# Altium schematic sheet bogdob.SchDoc
size A4; SheetNumber: 2; SheetTotal: 2
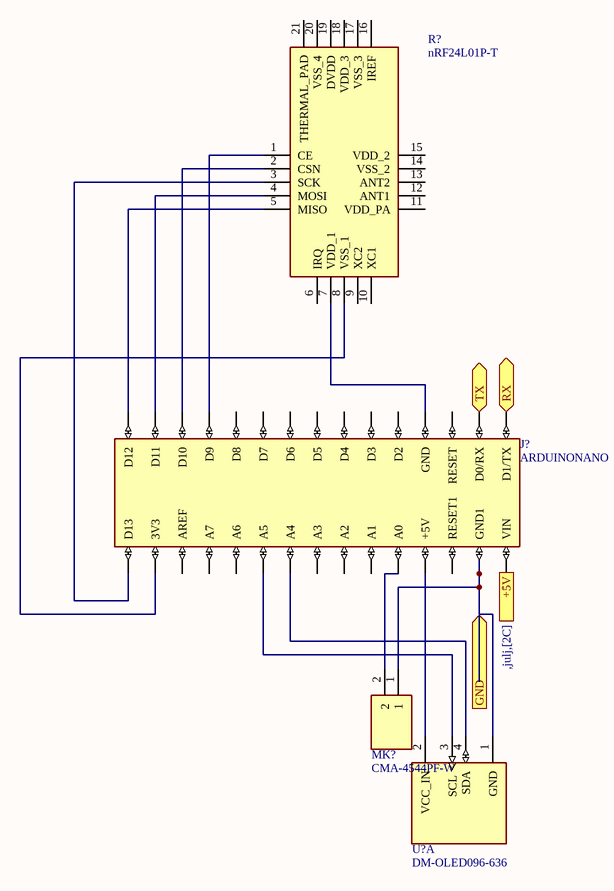
[diagram p0: bogdob.SchDoc]

## Parts
J?  ARDUINONANO  [PDIP-32]
MK?  CMA-4544PF-W  [CMA4544PFW]
R?  nRF24L01P-T  [QFN50P400X400X95-21N-D]
U?  DM-OLED096-636  [MODULE_DM-OLED096-636]  (part A of 6)

## Ports
+5V (in, see ,julj,[2C]), GND (in), RX (bidir), TX (bidir)

## Nets
RX: J?.D1/TX ; port RX
TX: J?.D0/RX ; port TX
NetJ?_3V3: J?.3V3 R?.8(VSS_1)
NetJ?_+5V: J?.+5V U?.2(VCC_IN)
NetJ?_A0: J?.A0 MK?.2
NetJ?_A4: J?.A4 U?.4(SDA)
NetJ?_A5: J?.A5 U?.3(SCL)
NetJ?_D9: J?.D9 R?.1(CE)
NetJ?_D10: J?.D10 R?.2(CSN)
NetJ?_D11: J?.D11 R?.4(MOSI)
NetJ?_D12: J?.D12 R?.5(MISO)
NetJ?_D13: J?.D13 R?.3(SCK)
NetJ?_GND: J?.GND R?.7(VDD_1)
NetJ?_GND1: J?.GND1 MK?.1 U?.1(GND)

Not connected (* = marked no-connect by the designer): J? A1 A2 A3 A6 A7 AREF D2 D3 D4 D5 D6 D7 D8 RESET RESET1 VIN; R? 6(IRQ) 9(XC2) 10(XC1) 11(VDD_PA) 12(ANT1) 13(ANT2) 14(VSS_2) 15(VDD_2) 16(IREF) 17(VSS_3) 18(VDD_3) 19(DVDD) 20(VSS_4) 21(THERMAL_PAD)

## Library data of the parts
J? = ARDUINONANO: NINA-W102, RP2040 Arduino Nano RP2040 Connect with Headers series ARMÂ® CortexÂ®-M0+ MCU 32-Bit Embedded Evaluation Board; Value: *; SnapEDA_Link: https://www.snapeda.com/parts/ARDUINONANO/Arduino/view-part/?ref=snap; MF: Arduino; Availability: Not in stock; Price: None; Package: Non-Standard Arduino; Check_prices: https://www.snapeda.com/parts/ARDUINONANO/Arduino/view-part/?ref=eda; MP: ARDUINONANO
MK? = CMA-4544PF-W: Microphone; Manufacturer_Name: CUI Devices; Datasheet Link: https://www.cuidevices.com/product/resource/cma-4544pf-w.pdf; Height: 4.65mm; Manufacturer_Part_Number: CMA-4544PF-W; Mouser Part Number: 490-CMA-4544PF-W; Mouser Price/Stock: https://www.mouser.co.uk/ProductDetail/CUI-Devices/CMA-4544PF-W?qs=WyjlAZoYn50RZRL7clQhww%3D%3D; Arrow Part Number: CMA-4544PF-W; Arrow Price/Stock: https://www.arrow.com/en/products/cma-4544pf-w/cui-devices?region=nac
R? = nRF24L01P-T: Integrated Circuit; Manufacturer_Name: Nordic Semiconductor; Datasheet Link: https://datasheet.datasheetarchive.com/originals/distributors/Datasheets-DGA19/4322.pdf; Height: 0.95mm; Manufacturer_Part_Number: nRF24L01P-T; Mouser Part Number: 949-NRF24L01P-T; Mouser Price/Stock: https://www.mouser.co.uk/ProductDetail/Nordic-Semiconductor/nRF24L01P-T?qs=yd0qOhnSiDf9ybbDsku6vg%3D%3D; Arrow Part Number: NRF24L01P-T; Arrow Price/Stock: null?region=nac
U? = DM-OLED096-636: 0.96â€ 128 X 64 MONOCHROME GRAPHIC OLED DISPLAY MODULE - I2C; SnapEDA_Link: https://www.snapeda.com/parts/DM-OLED096-636/Display+Module/view-part/?ref=snap; Package: Package; Value: *; MF: Display Module; MP: DM-OLED096-636; Check_prices: https://www.snapeda.com/parts/DM-OLED096-636/Display+Module/view-part/?ref=eda